# Altium schematic sheet MYBOARD_05-PWR.SchDoc
size A4
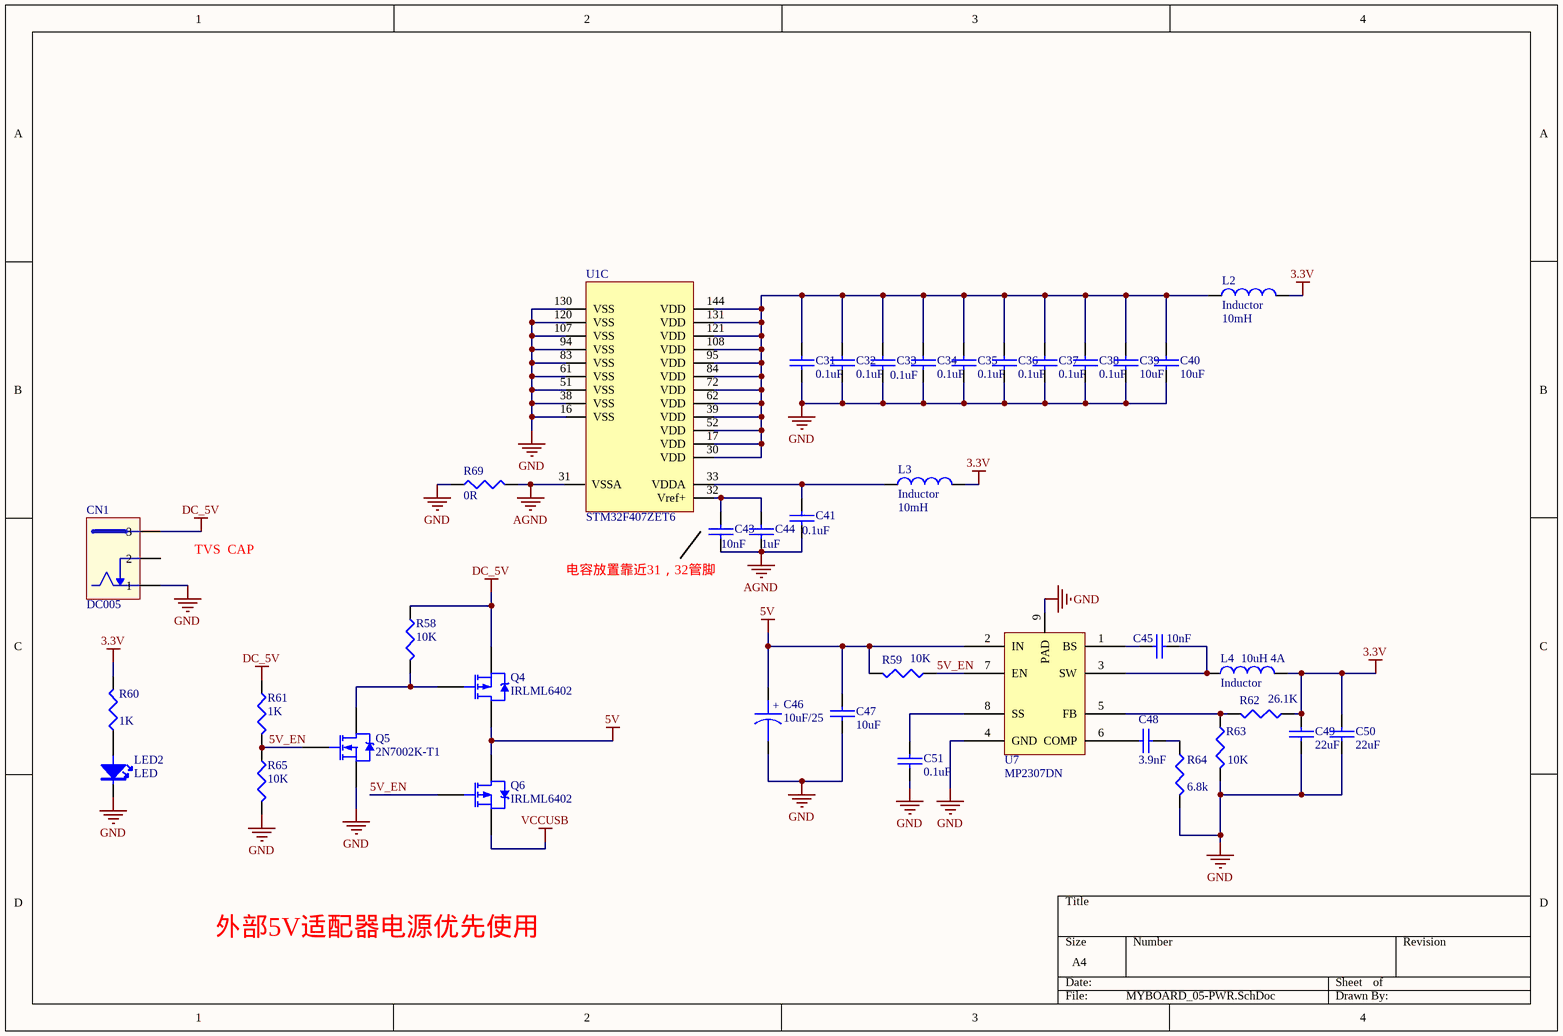
[diagram p0: MYBOARD_05-PWR.SchDoc]

## Parts
C31  0.1uF  [C0603_DWS]
C32  0.1uF  [C0603_DWS]
C33  0.1uF  [C0603_DWS]
C34  0.1uF  [C0603_DWS]
C35  0.1uF  [C0603_DWS]
C36  0.1uF  [C0603_DWS]
C37  0.1uF  [C0603_DWS]
C38  0.1uF  [C0603_DWS]
C39  10uF  [C0603_DWS]
C40  10uF  [C0603_DWS]
C41  0.1uF  [C0603_DWS]
C43  10nF  [C0603_DWS]
C44  1uF  [C0603_DWS]
C45  10nF  [C0603_DWS]
C46  10uF/25  [CAPAE7053X56M]
C47  10uF  [C1206]
C48  3.9nF  [C0603_DWS]
C49  22uF  [C1206]
C50  22uF  [C1206]
C51  0.1uF  [C0603_DWS]
CN1  DC005  [PWR_JACK_UNI_MILLING]
L2  Inductor  value 10mH  [0603]
L3  Inductor  value 10mH  [0603]
L4  Inductor  value 10uH 4A  [CD32]
LED2  LED  [LED-0603]
Q4  IRLML6402  [SOTFL95P264X112-3N]
Q5  2N7002K-T1  [SOT23]
Q6  IRLML6402  [SOTFL95P264X112-3N]
R58  value 10K  [R0603_5MIL_DWS]  (hidden comment: Res3)
R59  value 10K  [R0603_5MIL_DWS]  (hidden comment: Res3)
R60  value 1K  [R0603_5MIL_DWS]  (hidden comment: Res3)
R61  value 1K  [R0603_5MIL_DWS]  (hidden comment: Res3)
R62  value 26.1K  [R0603_5MIL_DWS]  (hidden comment: Res3)
R63  value 10K  [R0603_5MIL_DWS]  (hidden comment: Res3)
R64  value 6.8k  [R0603_5MIL_DWS]  (hidden comment: Res3)
R65  value 10K  [R0603_5MIL_DWS]  (hidden comment: Res3)
R69  value 0R  [R0603_5MIL_DWS]  (hidden comment: Res3)
U1  STM32F407ZET6  [LQFP144]  (part C of 3)
U7  MP2307DN  [SOIC-8]

## Nets
3.3V: C49.1 C50.1 L2.2 L3.2 L4.2 R60.2 R62.1
5V: C46.1 C47.1 Q4.3(D) Q6.3(D) R59.2 U7.2(IN)
AGND: C41.2 C43.2 C44.2 R69.2 U1.31(VSSA)
DC_5V: CN1.+(3) Q4.2(S) R58.1 R61.1
GND: C31.2 C32.2 C33.2 C34.2 C35.2 C36.2 C37.2 C38.2 C39.2 C40.2 C46.2 C47.2 C49.2 C50.2 C51.2 CN1.--(1) LED2.C Q5.2(S) R63.2 R64.2 R65.2 R69.1 U1.16(VSS) U1.38(VSS) U1.51(VSS) U1.61(VSS) U1.83(VSS) U1.94(VSS) U1.107(VSS) U1.120(VSS) U1.130(VSS) U7.4(GND) U7.9(PAD)
VCCUSB: Q6.2(S)
5V_EN: Q5.1(G) Q6.1(G) R59.1 R61.2 R65.1 U7.7(EN)
NetC31_1: C31.1 C32.1 C33.1 C34.1 C35.1 C36.1 C37.1 C38.1 C39.1 C40.1 L2.1 U1.17(VDD) U1.30(VDD) U1.39(VDD) U1.52(VDD) U1.62(VDD) U1.72(VDD) U1.84(VDD) U1.95(VDD) U1.108(VDD) U1.121(VDD) U1.131(VDD) U1.144(VDD)
NetC41_1: C41.1 L3.1 U1.33(VDDA)
NetC43_1: C43.1 C44.1 U1.32(Vref+)
NetC45_1: C45.1 U7.1(BS)
NetC45_2: C45.2 L4.1 U7.3(SW)
NetC48_1: C48.1 U7.6(COMP)
NetC48_2: C48.2 R64.1
NetC51_1: C51.1 U7.8(SS)
NetLED2_A: LED2.A R60.1
NetQ4_1: Q4.1(G) Q5.3(D) R58.2
NetR62_2: R62.2 R63.1 U7.5(FB)

Not connected (* = marked no-connect by the designer): CN1 -(2)

## Notes on the sheet
- TVS  CAP
- 电容放置靠近31，32管脚
- 外部5V适配器电源优先使用
- (in symbol EEE1EA100SR) +

## Library data of the parts
C31-C41 C43-C45 C47-C51 = CAP: Capacitor
C46 = EEE1EA100SR: Aluminum Electrolytic Capacitor SMD  Footprint:SizeCode_C; Manufacturer: Panasonic; Manufacturer Part Number: EEE1EA100SR
CN1 = DC005: 3pin, 5mm, DC input connect,
L2-L4 = Inductor: Code_IEC: 1005; Published: 8-Jun-2000; LatestRevisionDate: 29-May-2009; LatestRevisionNote: IPC-7351 Footprint Added.; PackageReference: 0402-A; Publisher: Altium Limited; PackageDescription: Chip Inductor; Code_JEITA: 0402
Q4 Q6 = IRLML6401: HEXFET Power MOSFET; Published: 17-Sep-2003; DatasheetVersion: 2-Jul-2001; PackageVersion: Jul-2001; PackageReference: Micro3; Publisher: Altium Limited; PackageDescription: 3-Pin SOT-23 Package 0.95 mm Pitch, 2.3 mm Lead Span; ComponentLink1Description: Manufacturer Link; ComponentLink1URL: http://www.irf.com/; ComponentLink2Description: Datasheet; ComponentLink2URL: http://www.irf.com/product-info/datasheets/data/IRLML6401.pdf
Q5 = 2N7002K-T1: N-MOS SOT-23
R58-R65 R69 = Res3: Resistor; Published: 8-Jun-2000; LatestRevisionDate: 29-May-2009; LatestRevisionNote: IPC-7351 Footprint Added.; PackageReference: J1-0603; Publisher: Altium Limited; PackageDescription: Chip Resistor
U7 = MP2307DN: DC-DC  4.75-23V INPUT SOIC-8  3A